# Altium schematic sheet [02] - SCH.SchDoc
size A4; SheetNumber: 2; SheetTotal: 2
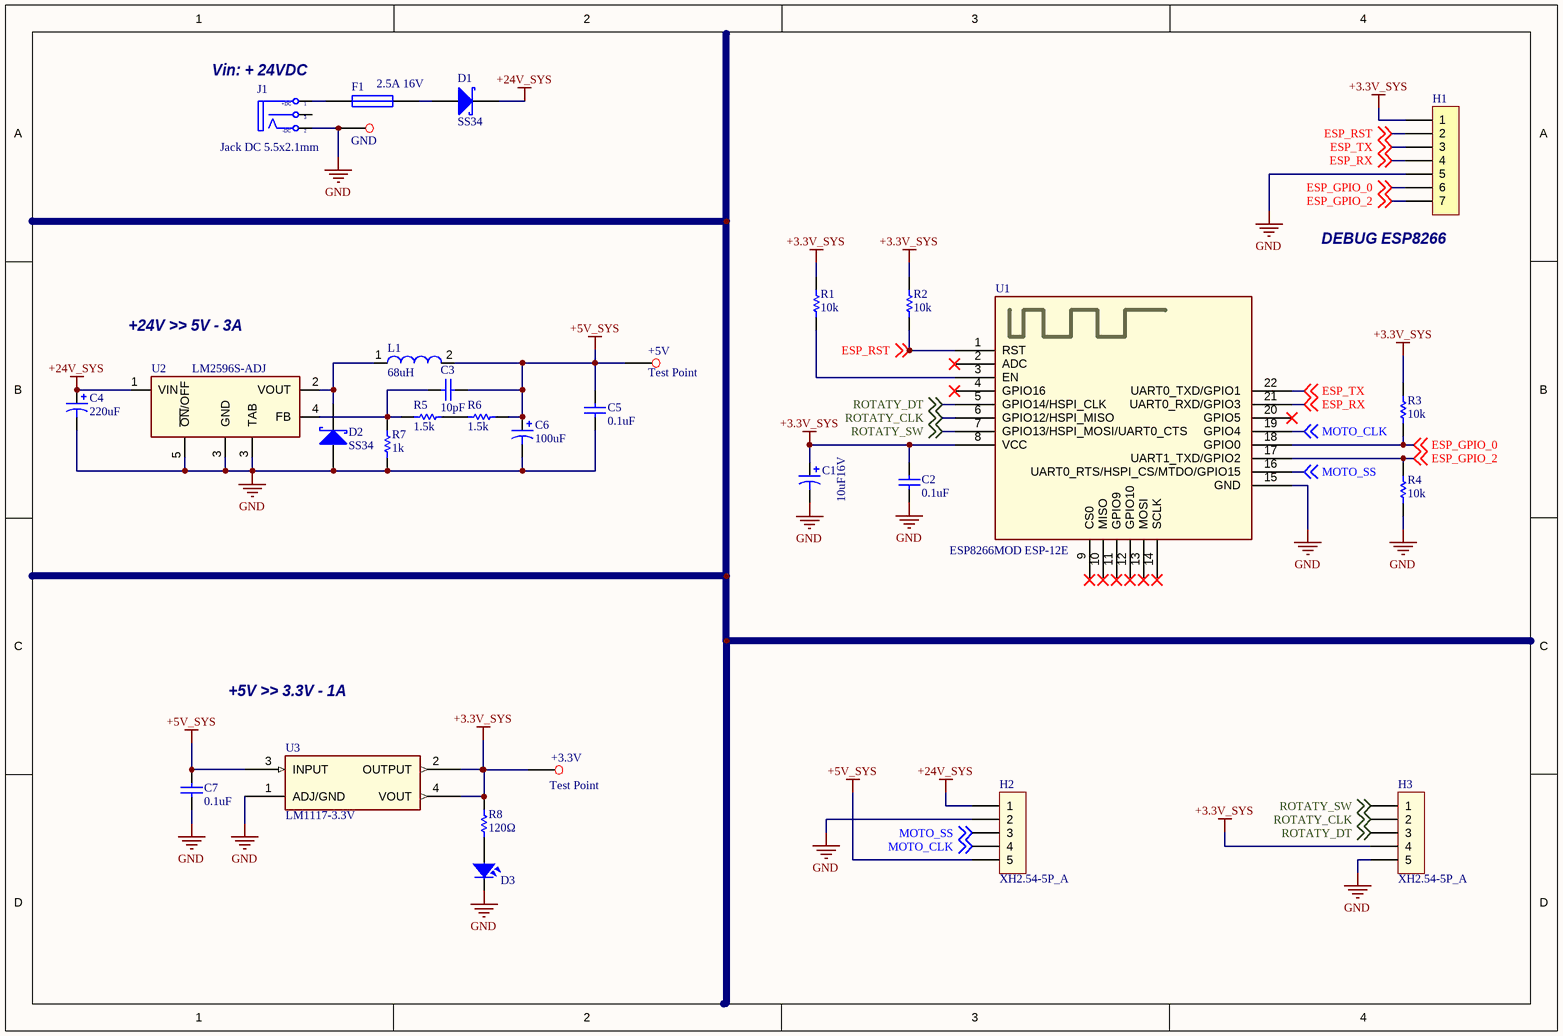
[diagram p0: [02] - SCH.SchDoc]

## Parts
+3.3V  Test Point  [Test Point]
+5V  Test Point  [Test Point]
C1  10uF16V  [CAP TANTALUM TAJA 1206]
C2  0.1uF  [Cap 0603]
C3  10pF  [Cap 0603]
C4  220uF  [Cap Aluminum UUD 10x10mm SMD]
C5  0.1uF  [Cap 0603]
C6  100uF  [Cap Aluminum UUD 8x10mm SMD]
C7  0.1uF  [Cap 0603]
D1  SS34  [DO-214AC]
D2  SS34  [DO-214AC]
D3  LED  [LED 0805-A]  (value not drawn)
F1  2.5A 16V  [Fuse 1812]
GND  Test Point  [Test Point]  (value not drawn)
H1  Header 2.54mm 1x7PIN  [Header 2.54MM 1x7PIN 180]  (value not drawn)
H2  XH2.54-5P_A  [XH2.54-5P_A]
H3  XH2.54-5P_A  [XH2.54-5P_A]
J1  Jack DC 5.5x2.1mm  [JACK DC 5.5x2.1mm]
L1  68uH  [Inductor CDRH127]
R1  10k  [Res 0603]
R2  10k  [Res 0603]
R3  10k  [Res 0603]
R4  10k  [Res 0603]
R5  1.5k  [Res 0603]
R6  1.5k  [Res 0603]
R7  1k  [Res 0603]
R8  120Ω  [Res 0603]
U1  ESP8266MOD ESP-12E  [Module ESP8266MOD ESP-12E]
U2  LM2596S-ADJ  [TO-263 5PIN]
U3  LM1117-3.3V  [SOT-223 4PIN]

## Nets
+3.3V_SYS: +3.3V.1 C1.1 C2.2 H1.1 H3.4 R1.2 R2.2 R3.2 R8.2 U1.8(VCC) U3.2(OUTPUT) U3.4(VOUT)
+5V_SYS: +5V.1 C3.1 C5.2 C6.1 C7.2 H2.5 L1.2(IN) R6.2 U3.3(INPUT)
+24V_SYS: C4.1 D1.2(K) H2.1 U2.1(VIN)
GND: C1.2 C2.1 C4.2 C5.1 C6.2 C7.1 D2.1(A) D3.2 GND.1 H1.5 H2.2 H3.5 J1.2(TN) R4.1 R7.1 U1.15(GND) U2.3(TAB) U2.5(~{ON}/OFF) U3.1(ADJ/GND)
ESP_GPIO_0: H1.6 R3.1 U1.18(GPIO0) ; off-sheet ESP_GPIO_0
ESP_GPIO_2: H1.7 R4.2 U1.17(UART1_TXD/GPIO2) ; off-sheet ESP_GPIO_2
ESP_RST: H1.2 R2.1 U1.1(RST) ; off-sheet ESP_RST
ESP_RX: H1.4 U1.21(UART0_RXD/GPIO3) ; off-sheet ESP_RX
ESP_TX: H1.3 U1.22(UART0_TXD/GPIO1) ; off-sheet ESP_TX
MOTO_CLK: H2.4 U1.19(GPIO4) ; off-sheet MOTO_CLK
MOTO_SS: H2.3 U1.16(UART0_RTS/HSPI_CS/MTDO/GPIO15) ; off-sheet MOTO_SS
ROTATY_CLK: H3.2 U1.6(GPIO12/HSPI_MISO) ; off-sheet ROTATY_CLK
ROTATY_DT: H3.3 U1.5(GPIO14/HSPI_CLK) ; off-sheet ROTATY_DT
ROTATY_SW: H3.1 U1.7(GPIO13/HSPI_MOSI/UART0_CTS) ; off-sheet ROTATY_SW
NetC3_2: C3.2 R5.1 R7.2 U2.4(FB)
NetD1_1: D1.1(A) F1.2
NetD2_2: D2.2(K) L1.1(IN) U2.2(VOUT)
NetD3_1: D3.1 R8.1
NetF1_1: F1.1 J1.1(T)
NetR1_1: R1.1 U1.3(EN)
NetR5_2: R5.2 R6.1

Not connected (* = marked no-connect by the designer): J1 3(S); U1 2(ADC)* 4(GPIO16)* 9(CS0)* 10(MISO)* 11(GPIO9)* 12(GPIO10)* 13(MOSI)* 14(SCLK)* 20(GPIO5)*

## Notes on the sheet
- (near J1) Vin: + 24VDC
- (near H1) DEBUG ESP8266
- +24V >> 5V - 3A
- +5V >> 3.3V - 1A
- DWG. NO.
- REV.
- SHT.
- REVISION
- DESCRIPTION
- DATE
- APPROVED
- THIS DOCUMENT AND THE DATA DISCLOSED HEREIN OR HEREWITH IS THE PROPERTY OF ALTIUM LIMITED AND MAY BE FREELY DISTRIBUTED IN WHOLE. NO RIGHTS ARE RESERVED OR EXPRESS OR IMPLIED WARANTEE GIVEN.
- ENG:
- DSN:
- APPROVALS
- PROJECT
- DOCUMENT REVISION:
- DESIGN ITEM:
- CHK:
- BOM:
- REFERENCE DOCUMENTS
- PROJECT REVISION:
- TITLE
- FAB DWG:
- PCB DWG:
- ASSY DWG:
- SCALE:
- SIZE
- C
- CAGE CODE
- FILE NAME
- DWG NO.
- SHEET
- OF
- REV
- (in symbol Jack DC 5.5x2.1mm) +DC; -DC

## Library data of the parts
+3.3V +5V GND = Test Point: Test Point 1.6mm, SMD
C1 = Cap Tantalum 1206 10uF16V: Capacitor Tantalum TAJA106K016RNJ, 10uF 16V 10%, 1206 SMD
C2 C5 C7 = Cap 0603 - 50V - 0.1uF: [LK00183] / Tụ điện Ceramic 0603 0.1uF, 50V, 10%
C3 = Cap 0603 - 50V - 10pF: [LK00370] / Tụ điện Ceramic 0603 10pF, 50V, 5%
C4 = Cap Aluminum 50V - 220uF: [LK00306] / Tụ Aluminum 220uF 50V 20%, 10x10.5mm, SMD (UUD1H221MNL1GS Nichicon)
C6 = Cap Aluminum 50V - 100uF: [LK00305] / Tụ Aluminum 100uF 50V 20%, 8x10.5mm, SMD (UUD1V101MNL1GS Nichicon)
D1 = Diode Schottky SS34: [LK00095] / Diode Schottky SS34, Small Signal Schottky Diode, Vrrm=40V, If=3A, SOD-80 SMD
D2 = Diode Schottky SS34: [LK00087] / Diode Schottky SS34, Small Signal Schottky Diode, Vrrm=40V, If=3A, SOD-80 SMD
D3 = LED 0805 SMD: LED 0805 SMD Green; Value: LED 3 - 5 ly 2 Colour
F1 = Fuse 1812 2.5A 16V: [LK00218] / Fuse PTC MF-MSMF250/16X, 2.5A 16V, 1812 SMD
H1 = Header 2.54mm 1x7PIN 180: Header male 2.54mm, 1x7PIN, 180 Degrees DIP
H2 H3 = XH2.54-5P_A: Bus, XH2.54-5PIN 2.54mm, 180 Degrees DIP
L1 = Inductor CDRH127 68uH: [LK00261] / Inductor CDRH127 68uH, 12X12X8mm, SMD
R1-R4 = Res 0603 - 1% - 10k: [LK00053] / Resistor 0603, 10k, 1%, 1/10W
R5 R6 = Res 0603 - 1% - 1.5k: [LK00050] / Resistor 0603, 1.5k, 1%, 1/10W
R7 = Res 0603 - 1% - 1k: [LK00054] / Resistor 0603, 1k, 1%, 1/10W
R8 = Res 0603 - 5% - 120Ω: [LK00234] / Resistor 0603 120R, 5%, 1/10W
U1 = Module ESP8266MOD ESP-12E: Module ESP8266MOD ESP-12E, SDIO 2.0-SPI-UART, 802.11b/g/n, 4MB Flash, 3-3.6V 80mA
U2 = LM2596S-ADJ: [LK00299] / IC Power LM2596S-ADJ, In Vmax 40V, Buck ADJ 3A, 1.23-37V, TO263-5 SMD
U3 = Power LM1117-3.3V: IC LM1117-3.3V, 8mA, Vmax=20V, SOT-223